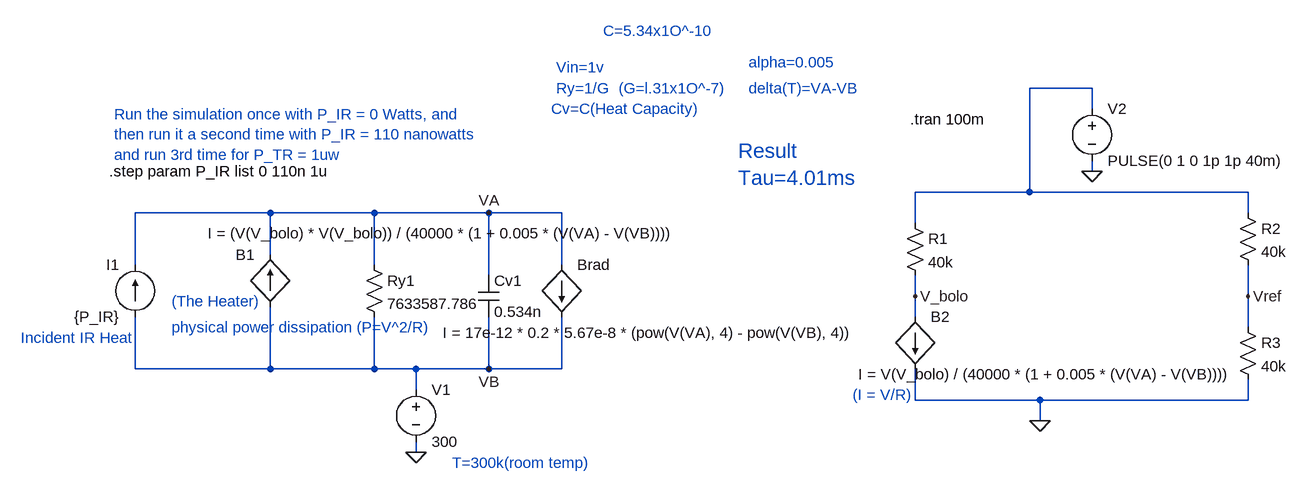
[diagram p0: schematic Micro_Bolometer(with-ir_radiation)_using_Coupled electro-thermal model.asc]
Micro_Bolometer(with-ir_radiation)_using_Coupled electro-thermal model.asc, the LTspice schematic file:
Version 4
SHEET 1 1148 680
WIRE 848 -320 752 -320
WIRE 848 -288 848 -320
WIRE 848 -192 848 -208
WIRE 752 -160 752 -320
WIRE 752 -160 576 -160
WIRE 1088 -160 752 -160
WIRE -416 -128 -624 -128
WIRE -256 -128 -416 -128
WIRE -80 -128 -256 -128
WIRE 32 -128 -80 -128
WIRE 1088 -128 1088 -160
WIRE 576 -112 576 -160
WIRE -416 -64 -416 -128
WIRE -624 -48 -624 -128
WIRE -256 -48 -256 -128
WIRE 32 -48 32 -128
WIRE -80 -32 -80 -128
WIRE 576 0 576 -32
WIRE 1088 0 1088 -48
WIRE 576 32 576 0
WIRE 1088 48 1088 0
WIRE -624 112 -624 32
WIRE -416 112 -416 16
WIRE -416 112 -624 112
WIRE -256 112 -256 32
WIRE -256 112 -416 112
WIRE -192 112 -256 112
WIRE -80 112 -80 32
WIRE -80 112 -192 112
WIRE 32 112 32 32
WIRE 32 112 -80 112
WIRE -192 144 -192 112
WIRE 576 160 576 112
WIRE 768 160 576 160
WIRE 1088 160 1088 128
WIRE 1088 160 768 160
WIRE 768 192 768 160
WIRE -192 240 -192 224
FLAG -192 240 0
FLAG 768 192 0
FLAG 848 -192 0
FLAG 576 0 V_bolo
FLAG -80 -128 VA
FLAG -80 112 VB
FLAG 1088 0 Vref
SYMBOL res -272 -64 R0
SYMATTR InstName Ry1
SYMATTR Value 7633587.786
SYMBOL cap -96 -32 R0
SYMATTR InstName Cv1
SYMATTR Value 0.534n
SYMBOL voltage -192 128 R0
WINDOW 123 0 0 Left 0
WINDOW 39 0 0 Left 0
SYMATTR InstName V1
SYMATTR Value 300
SYMBOL bi -416 16 R180
WINDOW 0 24 80 Left 2
WINDOW 3 -625 113 Left 2
SYMATTR InstName B1
SYMATTR Value I = (V(V_bolo) * V(V_bolo)) / (40000 * (1 + 0.005 * (V(VA) - V(VB))))
SYMBOL res 560 -128 R0
SYMATTR InstName R1
SYMATTR Value 40k
SYMBOL res 1072 -144 R0
SYMATTR InstName R2
SYMATTR Value 40k
SYMBOL res 1072 32 R0
SYMATTR InstName R3
SYMATTR Value 40k
SYMBOL bi 576 32 R0
WINDOW 3 -88 88 Left 2
SYMATTR Value I = V(V_bolo) / (40000 * (1 + 0.005 * (V(VA) - V(VB))))
SYMATTR InstName B2
SYMBOL voltage 848 -304 R0
WINDOW 123 0 0 Left 0
WINDOW 39 0 0 Left 0
SYMATTR InstName V2
SYMATTR Value PULSE(0 1 0 1p 1p 40m)
SYMBOL bi 32 -48 R0
WINDOW 3 452 104 Right 2
SYMATTR InstName Brad
SYMATTR Value I = 17e-12 * 0.2 * 5.67e-8 * (pow(V(VA), 4) - pow(V(VB), 4))
SYMBOL current -624 32 R180
WINDOW 0 24 80 Left 2
WINDOW 3 24 0 Left 2
SYMATTR InstName I1
SYMATTR Value {P_IR}
TEXT 24 -352 Left 2 ;Vin=1v
TEXT 24 -320 Left 2 ;Ry=1/G
TEXT 16 -288 Left 2 ;Cv=C(Heat Capacity)
TEXT -136 256 Left 2 ;T=300k(room temp)
TEXT 320 -360 Left 2 ;alpha=0.005
TEXT 320 -320 Left 2 ;delta(T)=VA-VB
TEXT 568 -272 Left 2 !.tran 100m
TEXT 120 -320 Left 2 ;(G=l.31x1O^-7)
TEXT 480 152 Left 2 ;(I = V/R)
TEXT -568 8 Left 2 ;(The Heater)
TEXT 96 -408 Left 2 ;C=5.34x1O^-10
TEXT 304 -224 Left 3 ;Result\nTau=4.01ms
TEXT -568 48 Left 2 ;physical power dissipation (P=V^2/R)
TEXT -664 -192 Left 2 !.step param P_IR list 0 110n 1u
TEXT -656 -280 Left 2 ;Run the simulation once with P_IR = 0 Watts, and \nthen run it a second time with P_IR = 110 nanowatts\nand run 3rd time for P_TR = 1uw
TEXT -800 64 Left 2 ;Incident IR Heat

The netlist it stands for:
* Micro_Bolometer(with-ir_radiation)_using_Coupled electro-thermal model.asc
Ry1 VA VB 7633587.786
Cv1 VA VB 0.534n
V1 VB 0 300
B1 VB VA I = (V(V_bolo) * V(V_bolo)) / (40000 * (1 + 0.005 * (V(VA) - V(VB))))
R1 N001 V_bolo 40k
R2 N001 Vref 40k
R3 Vref 0 40k
B2 V_bolo 0 I = V(V_bolo) / (40000 * (1 + 0.005 * (V(VA) - V(VB))))
V2 N001 0 PULSE(0 1 0 1p 1p 40m)
Brad VA VB I = 17e-12 * 0.2 * 5.67e-8 * (pow(V(VA), 4) - pow(V(VB), 4))
I1 VB VA {P_IR}
* Vin=1v
* Ry=1/G
* Cv=C(Heat Capacity)
* T=300k(room temp)
* alpha=0.005
* delta(T)=VA-VB
.tran 100m
* (G=l.31x1O^-7)
* (I = V/R)
* (The Heater)
* C=5.34x1O^-10
* Result
* Tau=4.01ms
* physical power dissipation (P=V^2/R)
.step param P_IR list 0 110n 1u
* Run the simulation once with P_IR = 0 Watts, and
* then run it a second time with P_IR = 110 nanowatts
* and run 3rd time for P_TR = 1uw
* Incident IR Heat
.backanno
.end